# EAGLE design RecFinal0 (EAGLE 7.2.0)
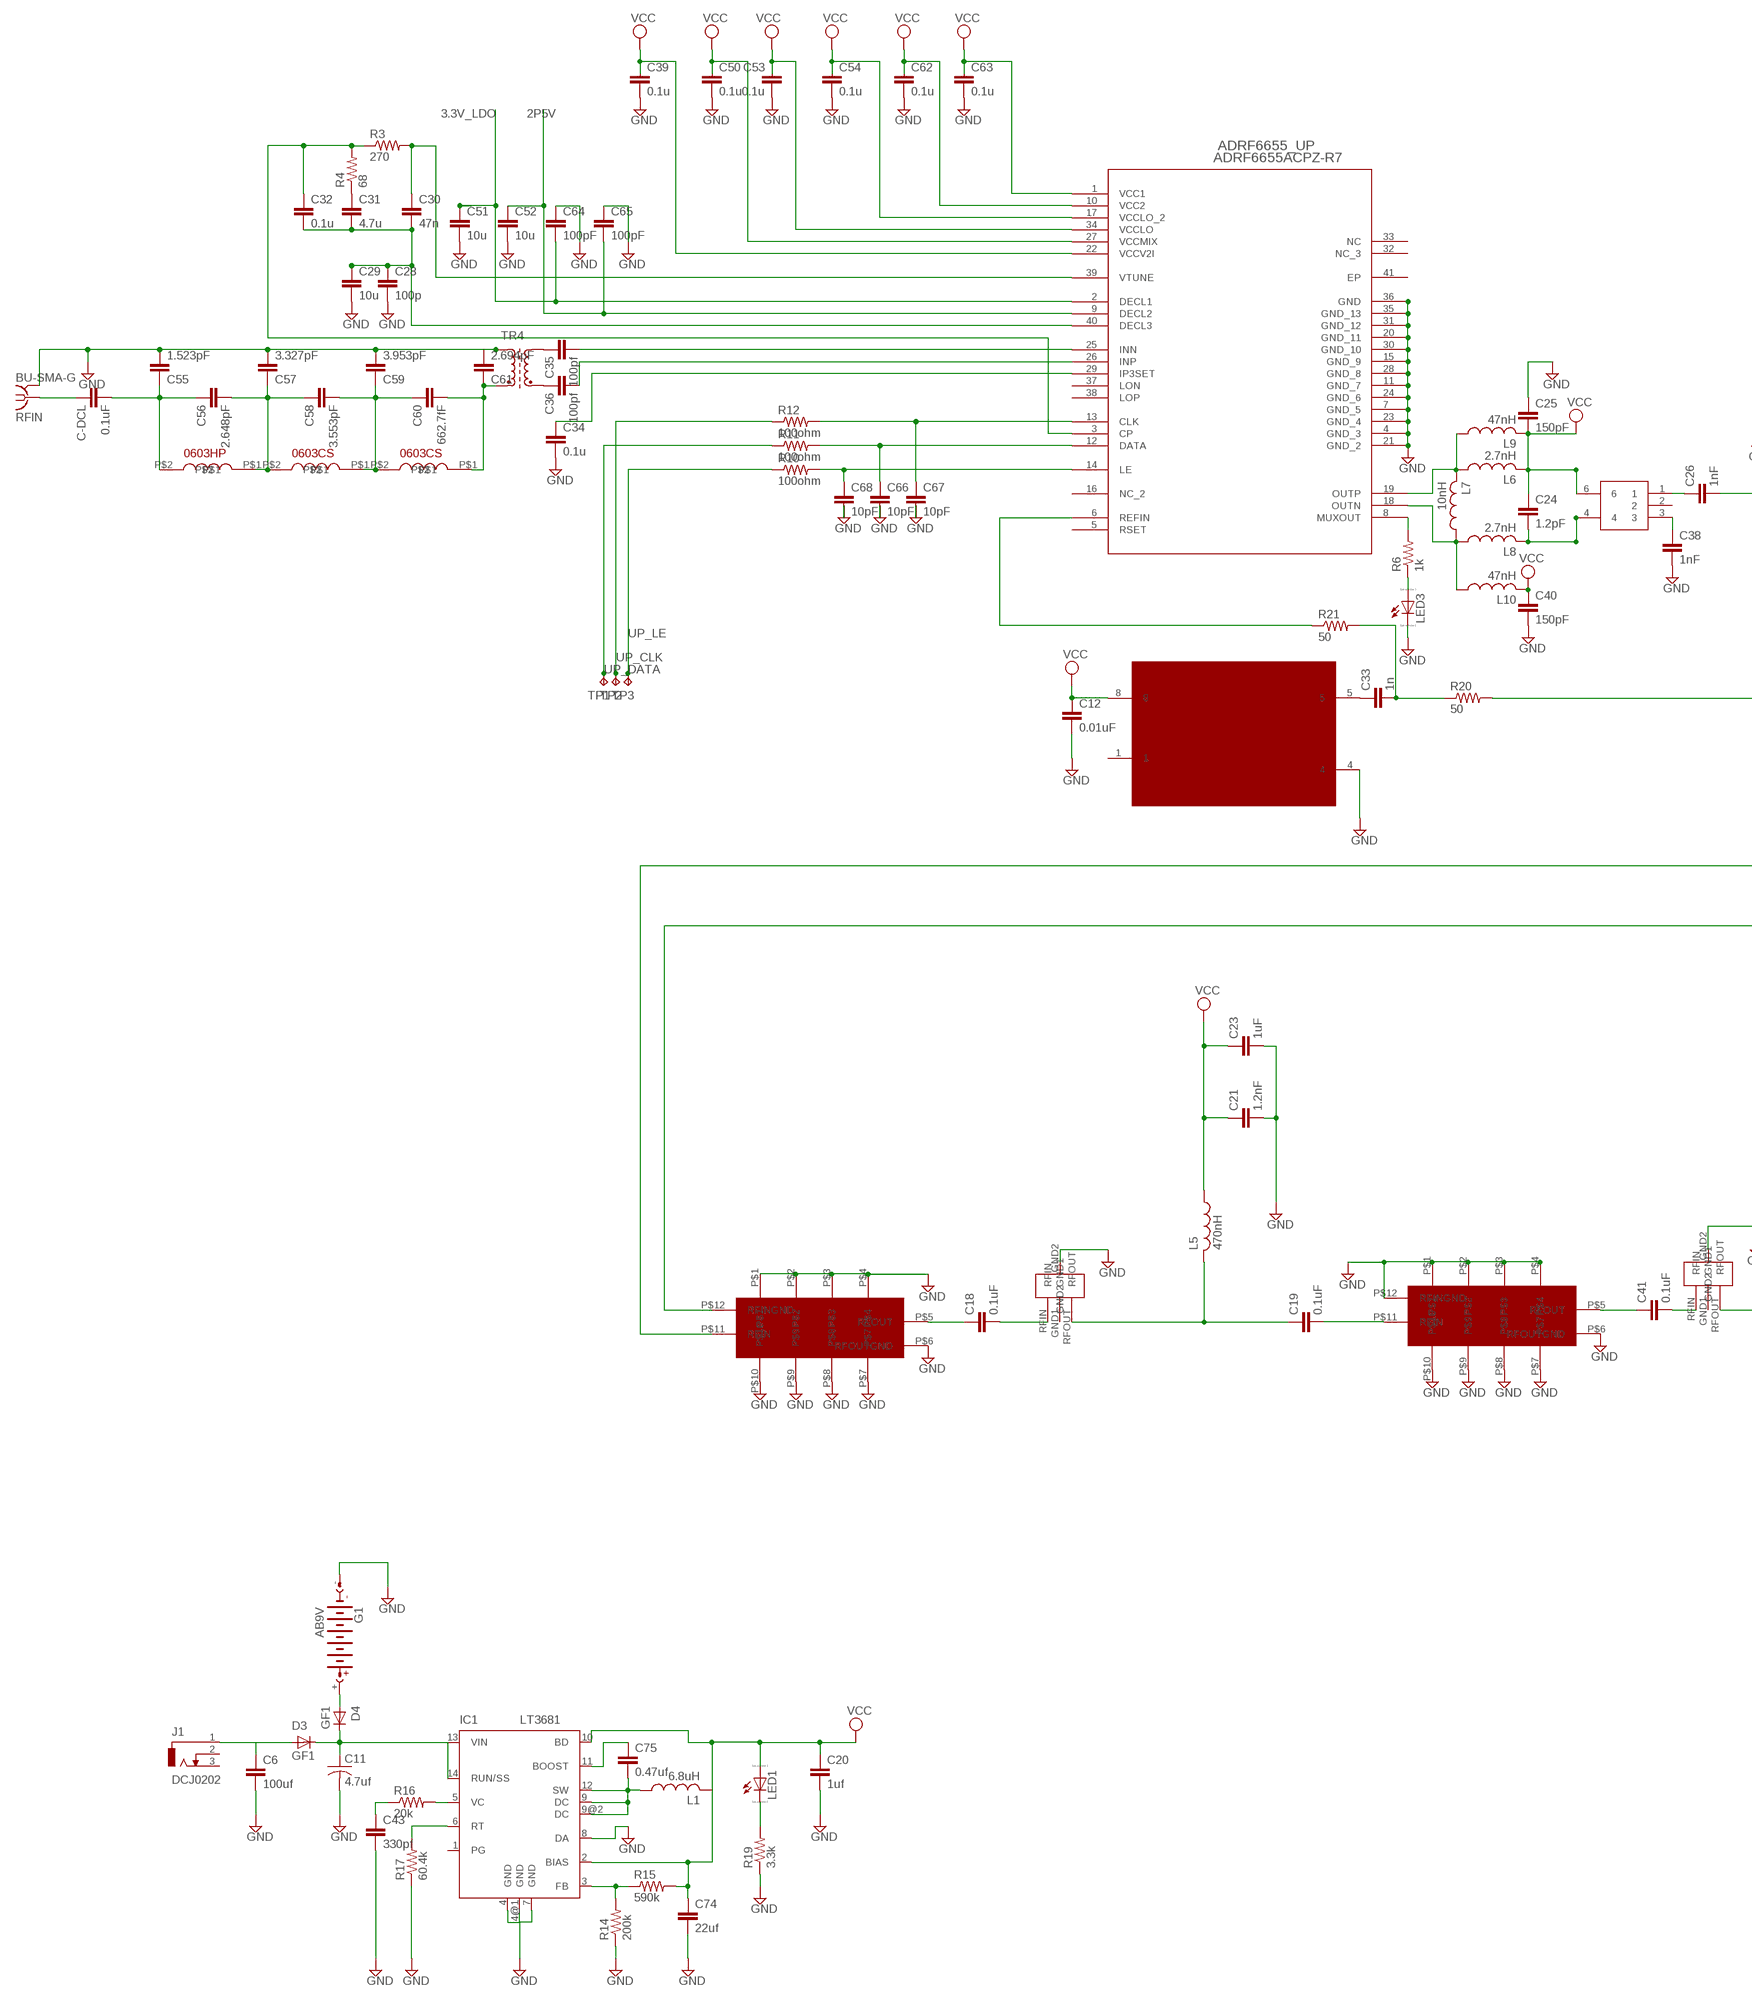
[diagram p0: schematic, sheet 1, part 1 of 2]
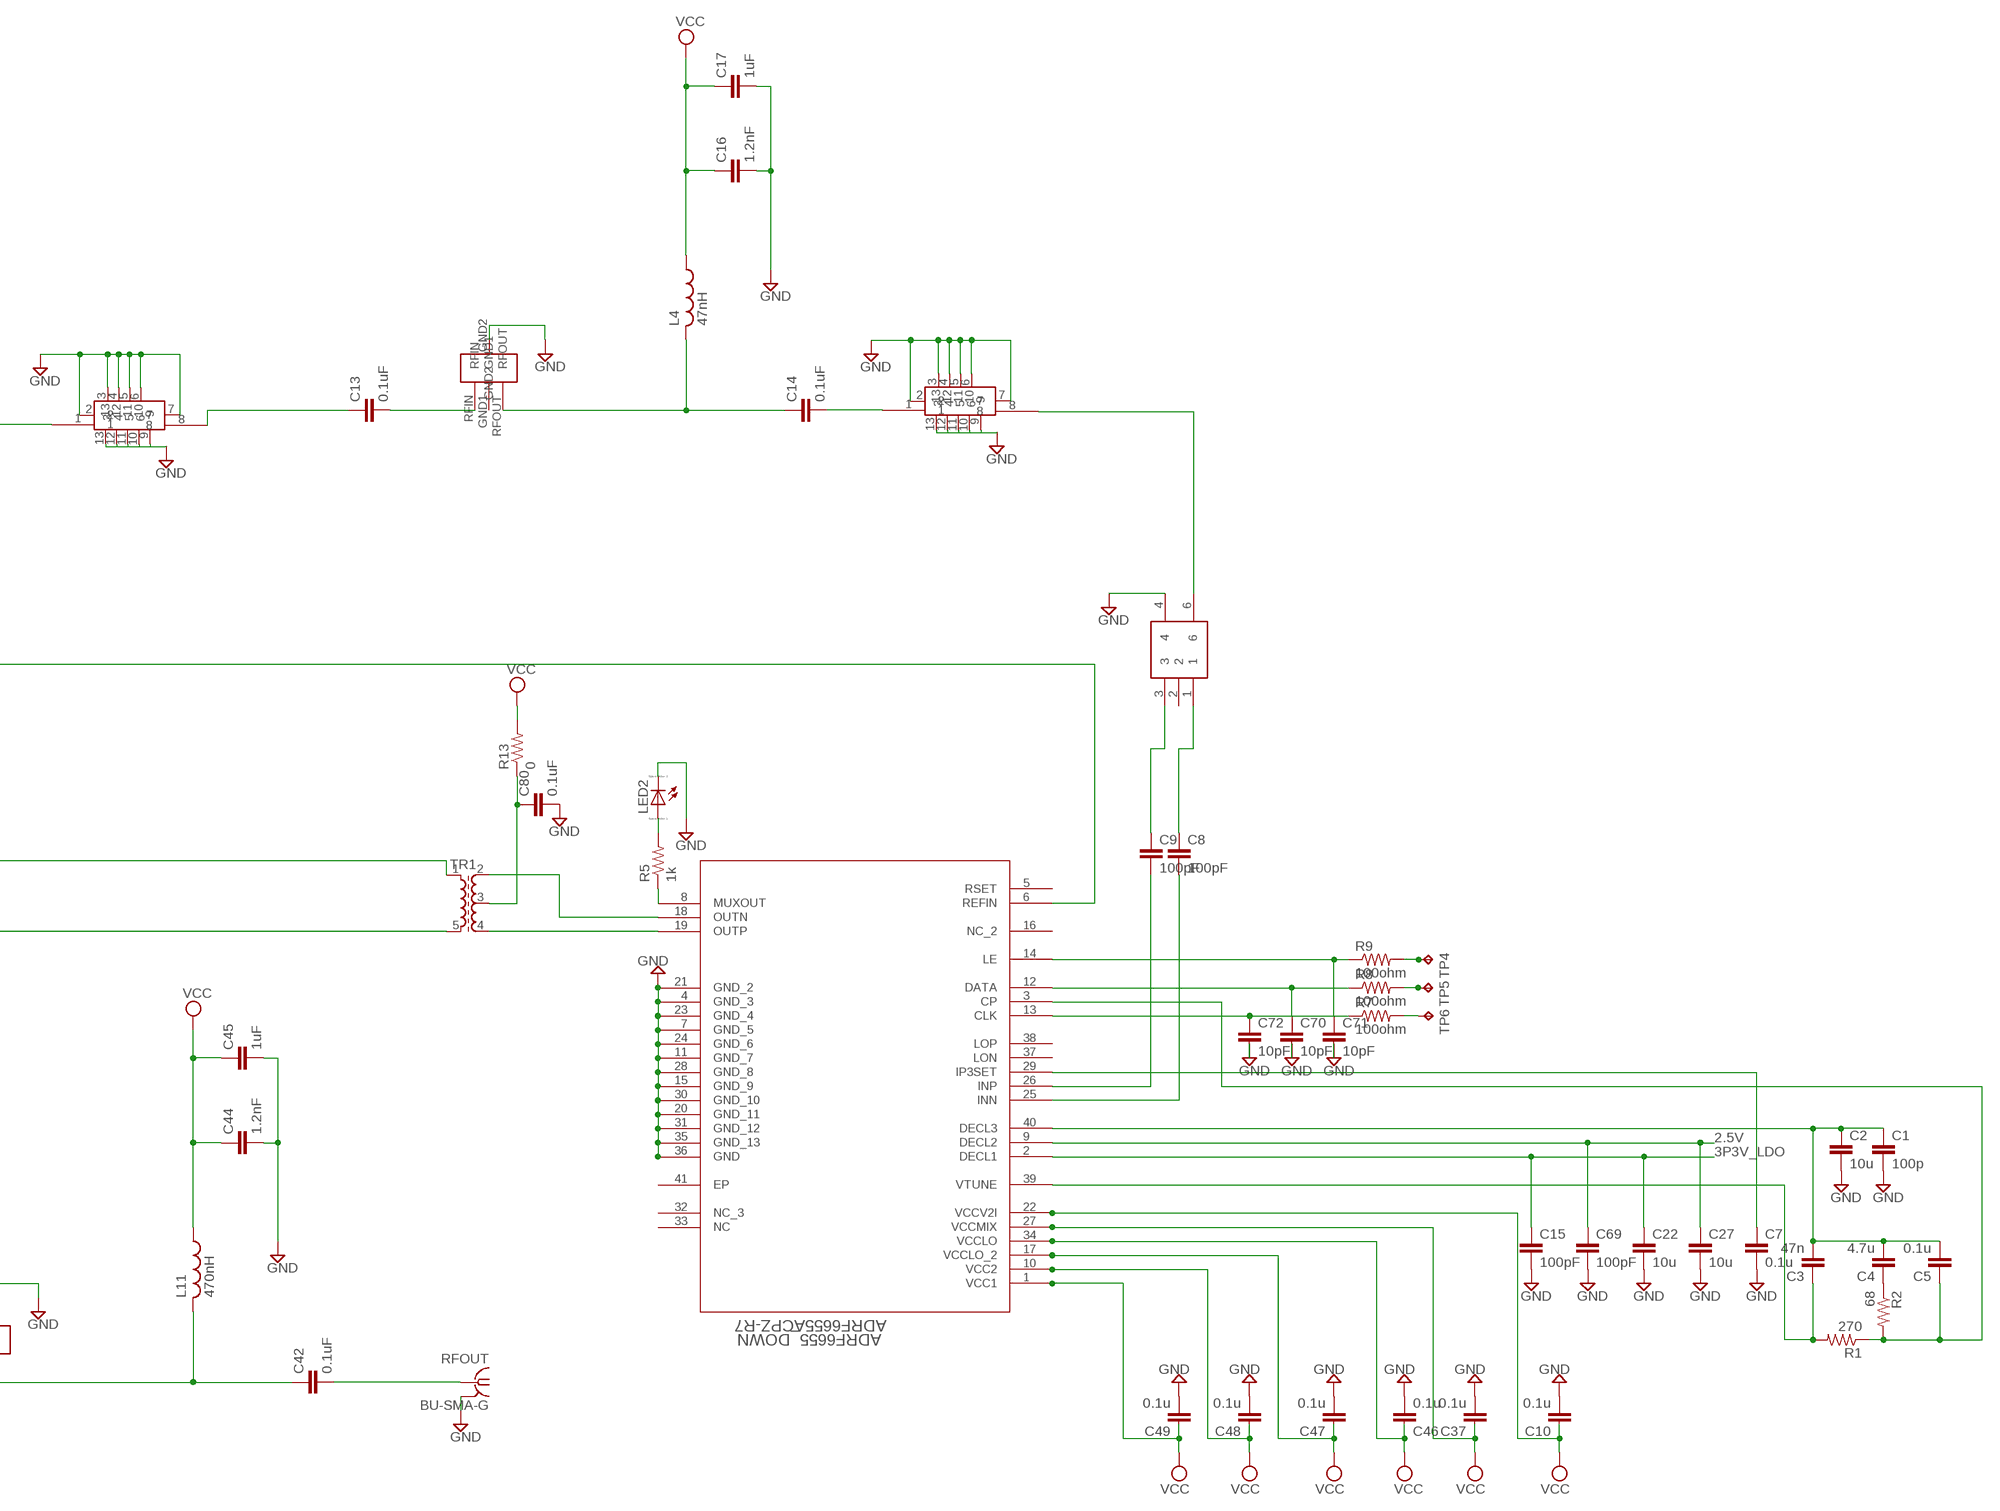
[diagram p1: schematic, sheet 1, part 2 of 2]

## Parts
06CS9N5  0603CS  [0603CS]
0603CS5N6  0603CS  [0603CS]
0603HP5N6  0603HP  [0603HP]
1401  SF2140A  [SF2140A]
1402  SF2140A  [SF2140A]
ADRF6655_DOWN  ADRF6655ACPZ-R7  [CP_40_1]
ADRF6655_UP  ADRF6655ACPZ-R7  [CP_40_1]
C1  100p  C-EUC0603K  [C0603K]
C2  10u  C-EUC0603K  [C0603K]
C3  47n  C-EUC0603K  [C0603K]
C4  4.7u  C-EUC0603K  [C0603K]
C5  0.1u  C-EUC0603K  [C0603K]
C6  100uf  C-EUC0603K  [C0603K]
C7  0.1u  C-EUC0603K  [C0603K]
C8  100pF  C-EUC0603K  [C0603K]
C9  100pF  C-EUC0603K  [C0603K]
C10  0.1u  C-EUC0603K  [C0603K]
C11  4.7uf  C-US050-024X044  [C050-024X044]
C12  0.01uF  C-EUC0603K  [C0603K]
C13  0.1uF  C-EUC0603K  [C0603K]
C14  0.1uF  C-EUC0603K  [C0603K]
C15  100pF  C-EUC0603K  [C0603K]
C16  1.2nF  C-EUC0603K  [C0603K]
C17  1uF  C-EUC0603K  [C0603K]
C18  0.1uF  C-EUC0603K  [C0603K]
C19  0.1uF  C-EUC0603K  [C0603K]
C20  1uf  C-EUC0603K  [C0603K]
C21  1.2nF  C-EUC0603K  [C0603K]
C22  10u  C-EUC0603K  [C0603K]
C23  1uF  C-EUC0603K  [C0603K]
C24  1.2pF  C-EUC0603K  [C0603K]
C25  150pF  C-EUC0603K  [C0603K]
C26  1nF  C-EUC0603K  [C0603K]
C27  10u  C-EUC0603K  [C0603K]
C28  100p  C-EUC0603K  [C0603K]
C29  10u  C-EUC0603K  [C0603K]
C30  47n  C-EUC0603K  [C0603K]
C31  4.7u  C-EUC0603K  [C0603K]
C32  0.1u  C-EUC0603K  [C0603K]
C33  1n  C-EUC0603K  [C0603K]
C34  0.1u  C-EUC0603K  [C0603K]
C35  100pf  C-EUC0603K  [C0603K]
C36  100pf  C-EUC0603K  [C0603K]
C37  0.1u  C-EUC0603K  [C0603K]
C38  1nF  C-EUC0603K  [C0603K]
C39  0.1u  C-EUC0603K  [C0603K]
C40  150pF  C-EUC0603K  [C0603K]
C41  0.1uF  C-EUC0603K  [C0603K]
C42  0.1uF  C-EUC0603K  [C0603K]
C43  330pf  C-EUC0603K  [C0603K]
C44  1.2nF  C-EUC0603K  [C0603K]
C45  1uF  C-EUC0603K  [C0603K]
C46  0.1u  C-EUC0603K  [C0603K]
C47  0.1u  C-EUC0603K  [C0603K]
C48  0.1u  C-EUC0603K  [C0603K]
C49  0.1u  C-EUC0603K  [C0603K]
C50  0.1u  C-EUC0603K  [C0603K]
C51  10u  C-EUC0603K  [C0603K]
C52  10u  C-EUC0603K  [C0603K]
C53  0.1u  C-EUC0603K  [C0603K]
C54  0.1u  C-EUC0603K  [C0603K]
C55  1.523pF  C-EUC0603K  [C0603K]
C56  2.648pF  C-EUC0603K  [C0603K]
C57  3.327pF  C-EUC0603K  [C0603K]
C58  3.553pF  C-EUC0603K  [C0603K]
C59  3.953pF  C-EUC0603K  [C0603K]
C60  662.7fF  C-EUC0603K  [C0603K]
C61  2.694pF  C-EUC0603K  [C0603K]
C62  0.1u  C-EUC0603K  [C0603K]
C63  0.1u  C-EUC0603K  [C0603K]
C64  100pF  C-EUC0603K  [C0603K]
C65  100pF  C-EUC0603K  [C0603K]
C66  10pF  C-EUC0603K  [C0603K]
C67  10pF  C-EUC0603K  [C0603K]
C68  10pF  C-EUC0603K  [C0603K]
C69  100pF  C-EUC0603K  [C0603K]
C70  10pF  C-EUC0603K  [C0603K]
C71  10pF  C-EUC0603K  [C0603K]
C72  10pF  C-EUC0603K  [C0603K]
C74  22uf  C-EUC0603K  [C0603K]
C75  0.47uf  C-EUC0603K  [C0603K]
C80  0.1uF  C-EUC0603K  [C0603K]
C-DCL  0.1uF  C-EUC0603K  [C0603K]
D3  GF1  [SMA-DO214AC]
D4  GF1  [SMA-DO214AC]
G1  AB9V  [AB9V]
IC1  LT3681  [DFN14-4X3DE]
J1  DCJ0202  [DCJ0202]
L1  6.8uH  L-USL2012C  [L2012C]
L4  47nH  L-USL2012C  [L2012C]
L5  470nH  L-USL2012C  [L2012C]
L6  2.7nH  L-USL2012C  [L2012C]
L7  10nH  L-USL2012C  [L2012C]
L8  2.7nH  L-USL2012C  [L2012C]
L9  47nH  L-USL2012C  [L2012C]
L10  47nH  L-USL2012C  [L2012C]
L11  470nH  L-USL2012C  [L2012C]
LED1  LED_ESML0603  [LED_SML0603]
LED2  LED_ESML0603  [LED_SML0603]
LED3  LED_ESML0603  [LED_SML0603]
R1  270  R-US_R0603  [R0603]
R2  68  R-US_R0603  [R0603]
R3  270  R-US_R0603  [R0603]
R4  68  R-US_R0603  [R0603]
R5  1k  R-US_R0603  [R0603]
R6  1k  R-US_R0603  [R0603]
R7  100ohm  R-US_R0603  [R0603]
R8  100ohm  R-US_R0603  [R0603]
R9  100ohm  R-US_R0603  [R0603]
R10  100ohm  R-US_R0603  [R0603]
R11  100ohm  R-US_R0603  [R0603]
R12  100ohm  R-US_R0603  [R0603]
R13  0  R-US_R0603  [R0603]
R14  200k  R-US_R0603  [R0603]
R15  590k  R-US_R0603  [R0603]
R16  20k  R-US_R0603  [R0603]
R17  60.4k  R-US_R0603  [R0603]
R19  3.3k  R-US_R0603  [R0603]
R20  50  R-US_R0603  [R0603]
R21  50  R-US_R0603  [R0603]
RFIN  BU-SMA-G  [BU-SMA-G]
RFOUT  BU-SMA-G  [BU-SMA-G]
T$2  CUSTOM_TRANSFORMER  [CUSTOM_TRANSFORMER]
T$3  CUSTOM_TRANSFORMER  [CUSTOM_TRANSFORMER]
TP1  TPPAD1-13  [P1-13]
TP2  TPPAD1-13  [P1-13]
TP3  TPPAD1-13  [P1-13]
TP4  TPPAD1-13  [P1-13]
TP5  TPPAD1-13  [P1-13]
TP6  TPPAD1-13  [P1-13]
TR1  SM-T4-2T  [SM-T4]
TR4  SM-T4  [SM-T4]
U$1  MXO45  [MXO45]
U$2  RCFD1  [RCFD1]
U$3  ADL5320  [ADL5320]
U$4  RCFD1  [RCFD1]
U$5  ADL5320  [ADL5320]
U$6  ADL5320  [ADL5320]

## Nets
2.5V: ADRF6655_DOWN.9(DECL2) C27.1 C69.1
2P5V: ADRF6655_UP.9(DECL2) C52.1 C65.2
3.3V_LDO: ADRF6655_UP.2(DECL1) C51.1 C64.2
3P3V_LDO: ADRF6655_DOWN.2(DECL1) C15.1 C22.1
DOWN_CLK: R7.2 TP6.TP
DOWN_DATA: R8.2 TP5.TP
DOWN_LE: R9.2 TP4.TP
GND: 1401.P$1 1401.P$2 1401.P$3 1401.P$4 1401.P$6(RFOUTGND) 1401.P$7 1401.P$8 1401.P$9 1401.P$10 1402.P$1 1402.P$2 1402.P$3 1402.P$4 1402.P$6(RFOUTGND) 1402.P$7 1402.P$8 1402.P$9 1402.P$10 1402.P$12(RFINGND) ADRF6655_DOWN.4(GND_3) ADRF6655_DOWN.7(GND_5) ADRF6655_DOWN.11(GND_7) ADRF6655_DOWN.15(GND_9) ADRF6655_DOWN.20(GND_11) ADRF6655_DOWN.21(GND_2) ADRF6655_DOWN.23(GND_4) ADRF6655_DOWN.24(GND_6) ADRF6655_DOWN.28(GND_8) ADRF6655_DOWN.30(GND_10) ADRF6655_DOWN.31(GND_12) ADRF6655_DOWN.35(GND_13) ADRF6655_DOWN.36(GND) ADRF6655_UP.4(GND_3) ADRF6655_UP.7(GND_5) ADRF6655_UP.11(GND_7) ADRF6655_UP.15(GND_9) ADRF6655_UP.20(GND_11) ADRF6655_UP.21(GND_2) ADRF6655_UP.23(GND_4) ADRF6655_UP.24(GND_6) ADRF6655_UP.28(GND_8) ADRF6655_UP.30(GND_10) ADRF6655_UP.31(GND_12) ADRF6655_UP.35(GND_13) ADRF6655_UP.36(GND) C1.2 C2.2 C6.2 C7.2 C10.2 C11.2 C12.2 C15.2 C16.2 C17.2 C20.2 C21.2 C22.2 C23.2 C25.1 C27.2 C28.2 C29.2 C34.2 C37.2 C38.2 C39.2 C40.2 C43.2 C44.2 C45.2 C46.2 C47.2 C48.2 C49.2 C50.2 C51.2 C52.2 C53.2 C54.2 C55.2 C57.2 C59.2 C61.2 C62.2 C63.2 C64.1 C65.1 C66.2 C67.2 C68.2 C69.2 C70.2 C71.2 C72.2 C74.2 C80.2 G1.- IC1.4(GND) IC1.4@1(GND) IC1.7(GND) IC1.8(DA) LED2.C LED3.C R14.1 R17.1 R19.1 RFIN.2 RFIN.3 RFIN.4 RFIN.5 RFOUT.2 RFOUT.3 RFOUT.4 RFOUT.5 T$3.4 TR4.1(A1) U$1.4 U$2.2 U$2.3 U$2.4 U$2.5 U$2.6 U$2.7 U$2.9 U$2.10 U$2.11 U$2.12 U$2.13 U$4.2 U$4.3 U$4.4 U$4.5 U$4.6 U$4.7 U$4.9 U$4.10 U$4.11 U$4.12 U$4.13 U$5.GND2
N$1: ADRF6655_UP.39(VTUNE) C30.1 R3.2
N$2: ADRF6655_DOWN.39(VTUNE) C3.1 R1.2
N$4: ADRF6655_DOWN.40(DECL3) C1.1 C2.1 C3.2 C4.2 C5.2
N$5: ADRF6655_DOWN.6(REFIN) R20.2
N$6: ADRF6655_DOWN.14(LE) C71.1 R9.1
N$7: ADRF6655_DOWN.12(DATA) C70.1 R8.1
N$8: ADRF6655_DOWN.29(IP3SET) C7.1
N$9: ADRF6655_DOWN.26(INP) C9.2
N$10: ADRF6655_DOWN.25(INN) C8.2
N$11: ADRF6655_DOWN.18(OUTN) TR1.2
N$12: ADRF6655_DOWN.19(OUTP) TR1.4
N$13: C38.1 T$2.3
N$14: ADRF6655_UP.3(CP) C32.1 R3.1 R4.2
N$15: ADRF6655_UP.40(DECL3) C28.1 C29.1 C30.2 C31.2 C32.2
N$16: C33.1 U$1.5
N$17: C26.2 U$2.1
N$18: ADRF6655_UP.13(CLK) C67.1 R12.2
N$19: ADRF6655_UP.29(IP3SET) C34.1
N$20: ADRF6655_UP.25(INN) C35.2
N$21: ADRF6655_UP.26(INP) C36.2
N$22: C-DCL.1 RFIN.1
N$23: 0603HP5N6.P$2 C55.1 C56.1 C-DCL.2
N$24: C41.2 U$5.RFIN
N$25: 06CS9N5.P$1 C60.2 C61.1 TR4.2(E1)
N$26: 06CS9N5.P$2 0603CS5N6.P$1 C58.2 C59.1 C60.1
N$27: 0603CS5N6.P$2 0603HP5N6.P$1 C56.2 C57.1 C58.1
N$28: C13.1 U$2.8
N$29: ADRF6655_UP.12(DATA) C66.1 R11.2
N$30: C31.1 R4.1
N$31: C4.1 R2.1
N$32: C14.1 L4.2 U$3.RFOUT
N$33: ADRF6655_UP.8(MUXOUT) R6.2
N$34: LED3.A R6.1
N$35: C14.2 U$4.1
N$37: IC1.5(VC) R16.2
N$38: ADRF6655_DOWN.3(CP) C5.1 R1.1 R2.2
N$39: C19.1 L5.2 U$6.RFOUT
N$40: 1401.P$5(RFOUT) C18.1
N$41: 1402.P$11(RFIN) C19.2
N$42: ADRF6655_UP.19(OUTP) L6.1 L7.2 L9.1
N$43: ADRF6655_UP.18(OUTN) L7.1 L8.1 L10.1
N$44: ADRF6655_DOWN.13(CLK) C72.1 R7.1
N$45: T$3.6 U$4.8
N$47: C24.2 L8.2 T$2.4
N$48: ADRF6655_UP.6(REFIN) R21.1
N$49: C33.2 R20.1 R21.2
N$50: C80.1 R13.1 TR1.3
N$51: 1401.P$12(RFINGND) TR1.5
N$52: 1401.P$11(RFIN) TR1.1
N$53: C18.2 U$6.RFIN
N$54: C42.1 L11.2 U$5.RFOUT
N$55: 1402.P$5(RFOUT) C41.1
N$56: C42.2 RFOUT.1
N$57: C9.1 T$3.3
N$58: C8.1 T$3.1
N$59: C35.1 TR4.5(A2)
N$60: C36.1 TR4.4(E2)
N$61: ADRF6655_UP.14(LE) C68.1 R10.2
N$62: ADRF6655_DOWN.8(MUXOUT) R5.1
N$63: C13.2 U$3.RFIN
N$64: C26.1 T$2.1
N$65: IC1.6(RT) R17.2
N$66: C43.1 R16.1
N$67: IC1.3(FB) R14.2 R15.1
N$69: C75.1 IC1.11(BOOST)
N$72: LED2.A R5.2
N$73: C11.1 D3.K(C) D4.K(C) IC1.13(VIN) IC1.14(RUN/SS)
N$74: D4.A G1.+
N$75: C75.2 IC1.9(DC) IC1.9@2(DC) IC1.12(SW) L1.1
N$76: LED1.C R19.2
N$78: C6.1 D3.A J1.1
UP_CLK: R12.1 TP2.TP
UP_DATA: R11.1 TP1.TP
UP_LE: R10.1 TP3.TP
VCC: ADRF6655_DOWN.1(VCC1) ADRF6655_DOWN.10(VCC2) ADRF6655_DOWN.17(VCCLO_2) ADRF6655_DOWN.22(VCCV2I) ADRF6655_DOWN.27(VCCMIX) ADRF6655_DOWN.34(VCCLO) ADRF6655_UP.1(VCC1) ADRF6655_UP.10(VCC2) ADRF6655_UP.17(VCCLO_2) ADRF6655_UP.22(VCCV2I) ADRF6655_UP.27(VCCMIX) ADRF6655_UP.34(VCCLO) C10.1 C12.1 C16.1 C17.1 C20.1 C21.1 C23.1 C24.1 C25.2 C37.1 C39.1 C40.1 C44.1 C45.1 C46.1 C47.1 C48.1 C49.1 C50.1 C53.1 C54.1 C62.1 C63.1 C74.1 IC1.2(BIAS) IC1.10(BD) L1.2 L4.1 L5.1 L6.2 L9.2 L10.2 L11.1 LED1.A R13.2 R15.2 T$2.6 U$1.8
Unconnected: ADRF6655_DOWN.5(RSET) ADRF6655_DOWN.16(NC_2) ADRF6655_DOWN.32(NC_3) ADRF6655_DOWN.33(NC) ADRF6655_DOWN.37(LON) ADRF6655_DOWN.38(LOP) ADRF6655_DOWN.41(EP) ADRF6655_UP.5(RSET) ADRF6655_UP.16(NC_2) ADRF6655_UP.32(NC_3) ADRF6655_UP.33(NC) ADRF6655_UP.37(LON) ADRF6655_UP.38(LOP) ADRF6655_UP.41(EP) IC1.1(PG) J1.2 J1.3 T$2.2 T$3.2 U$1.1 U$3.GND1 U$3.GND2 U$5.GND1 U$6.GND1 U$6.GND2

## Library data of the parts
06CS9N5 0603CS5N6 = 0603CS:0603CS
0603HP5N6 = 0603HP:0603HP
1401 1402 = sf2140a:SF2140A
ADRF6655_DOWN ADRF6655_UP = adrf6655:ADRF6655ACPZ-R7
C1-C10 C12-C72 C74 C75 C80 C-DCL = rcl:C-EU: CAPACITOR, European symbol
C11 = rcl:C-US: CAPACITOR, American symbol
D3 D4 = diode:GF1: DIODE
G1 = battery:AB9V: 9-V BATTERY CLIP
IC1 = linear-technology:LT3681: 36V, 2A, 2.8MHz Step-Down Switching Regulator with Integrated Power Schottky Diode Source: http://www.linear.com/pc/downloadDocument.do?navId=H0,C1,C1003,C1042,C1032,C1064,P38040,D25144; MPN: LT3681EDE#PBF; OC_FARNELL: 1627603; OC_NEWARK: 57M8550
J1 = con-jack:DCJ0202: DC POWER JACK Source: DCJ0202.pdf; OC_FARNELL: unknown; OC_NEWARK: unknown
L1 L4-L11 = rcl:L-US: INDUCTOR, American symbol
LED1-LED3 = eagle-ltspice:LED_E: LED Source: http://www.osram.convergy.de Source: www.luxeon.com Source: www.kingbright.com; SPICEMODEL: NONE; SPICEPREFIX: D; SPICETYPE: diode
R1-R4 R7-R12 R20 R21 = rcl:R-US_: RESISTOR, American symbol
R5 R6 R13-R17 R19 = resistor:R-US_: RESISTOR, American symbol
RFIN RFOUT = con-coax:BU-SMA-G: FEMALE SMA CONNECTOR Radiall distributor RS 193-9117; OC_FARNELL: unknown; OC_NEWARK: unknown
T$2 T$3 = CUSTOM_TRANSFORMER:CUSTOM_TRANSFORMER
TP1-TP6 = testpad:TP: Test pad
TR1 = inductor-neosid:SM-T4-2T: TRANSFORMER SMD wideband transformer with tab; OC_FARNELL: unknown; OC_NEWARK: unknown
TR4 = inductor-neosid:SM-T4: TRANSFORMER SMD wideband transformer; OC_FARNELL: unknown; OC_NEWARK: unknown
U$1 = mxo45:MXO45
U$2 U$4 = RCFD1:RCFD1
U$3 U$5 U$6 = ADL5320:ADL5320

## Board
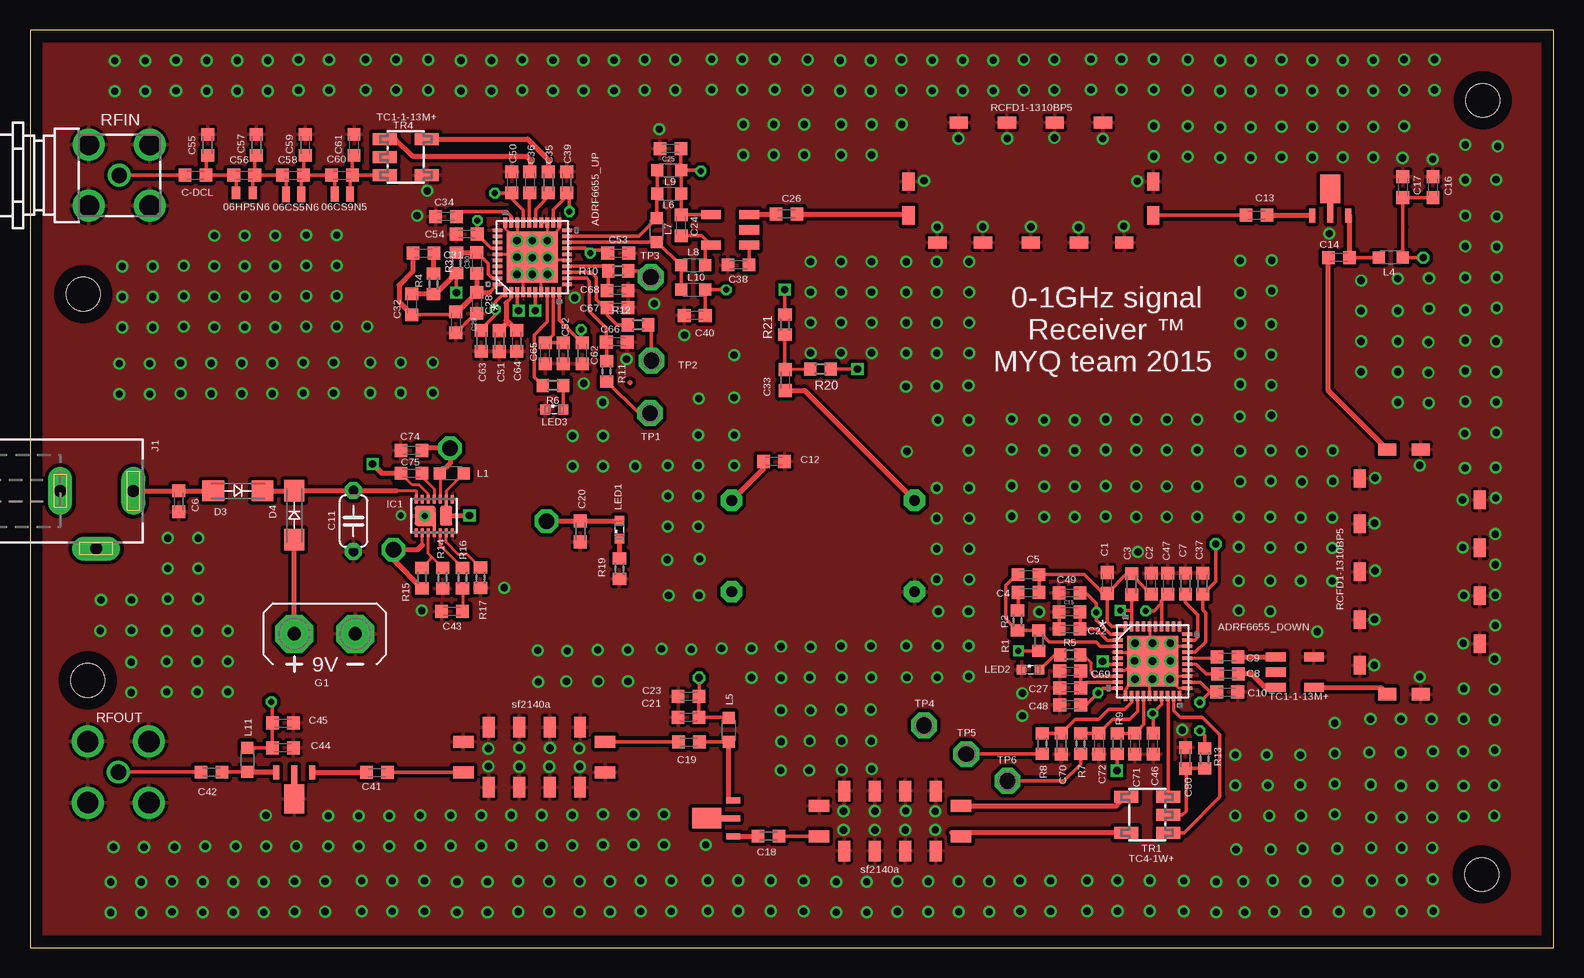
[diagram p2: board, top side]
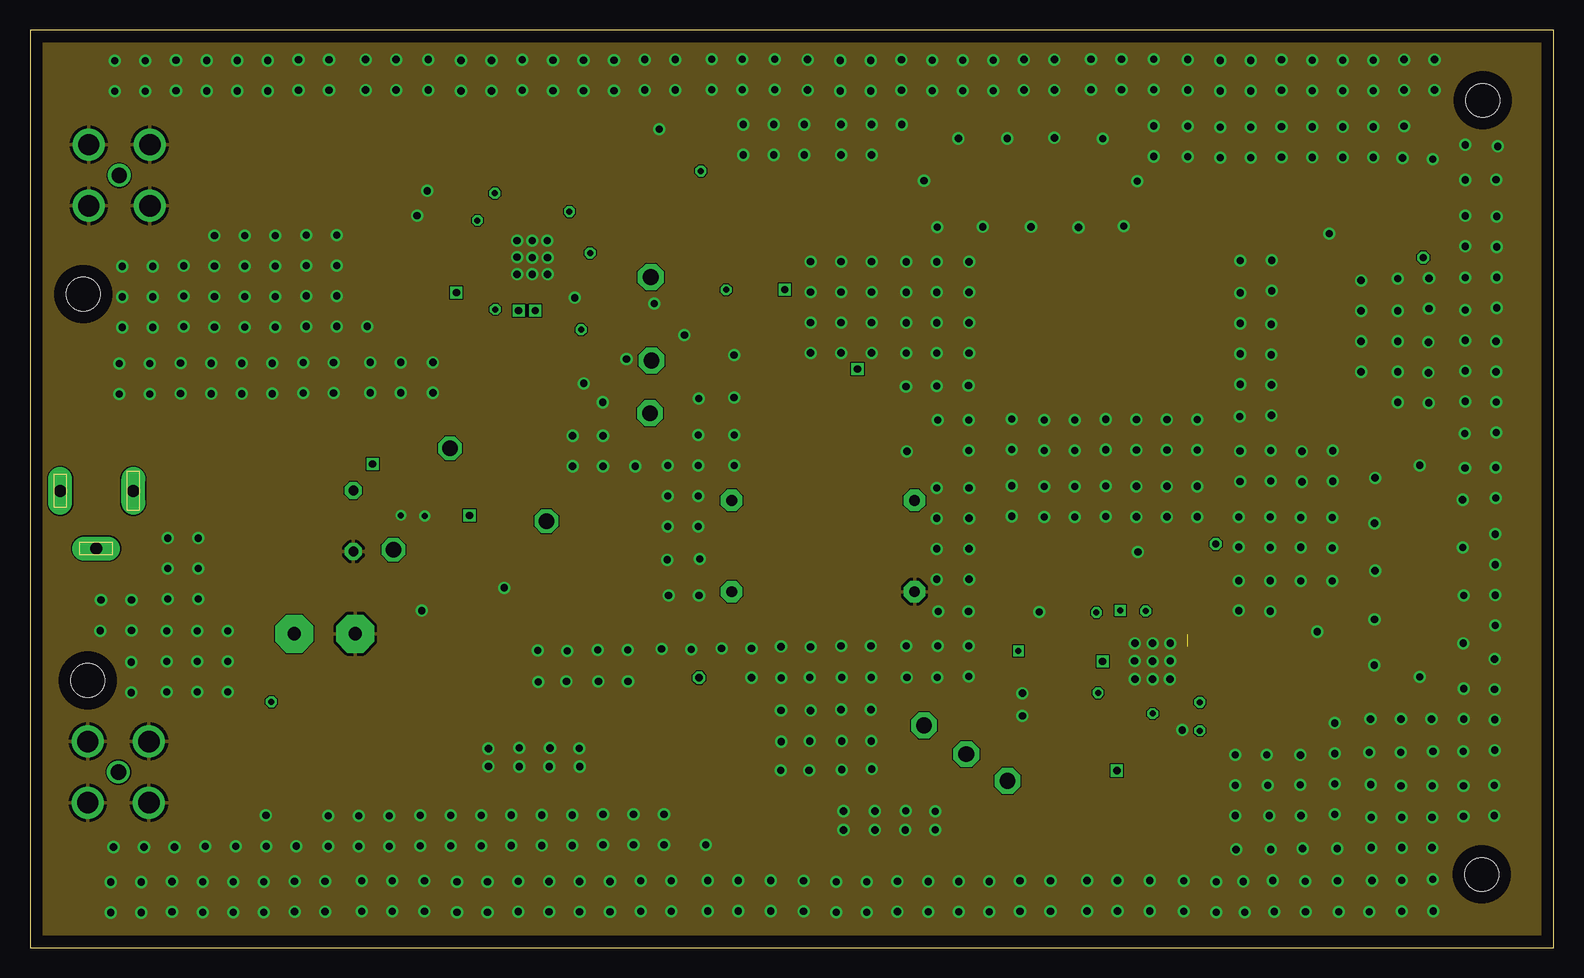
[diagram p3: board, inner layer Route2]
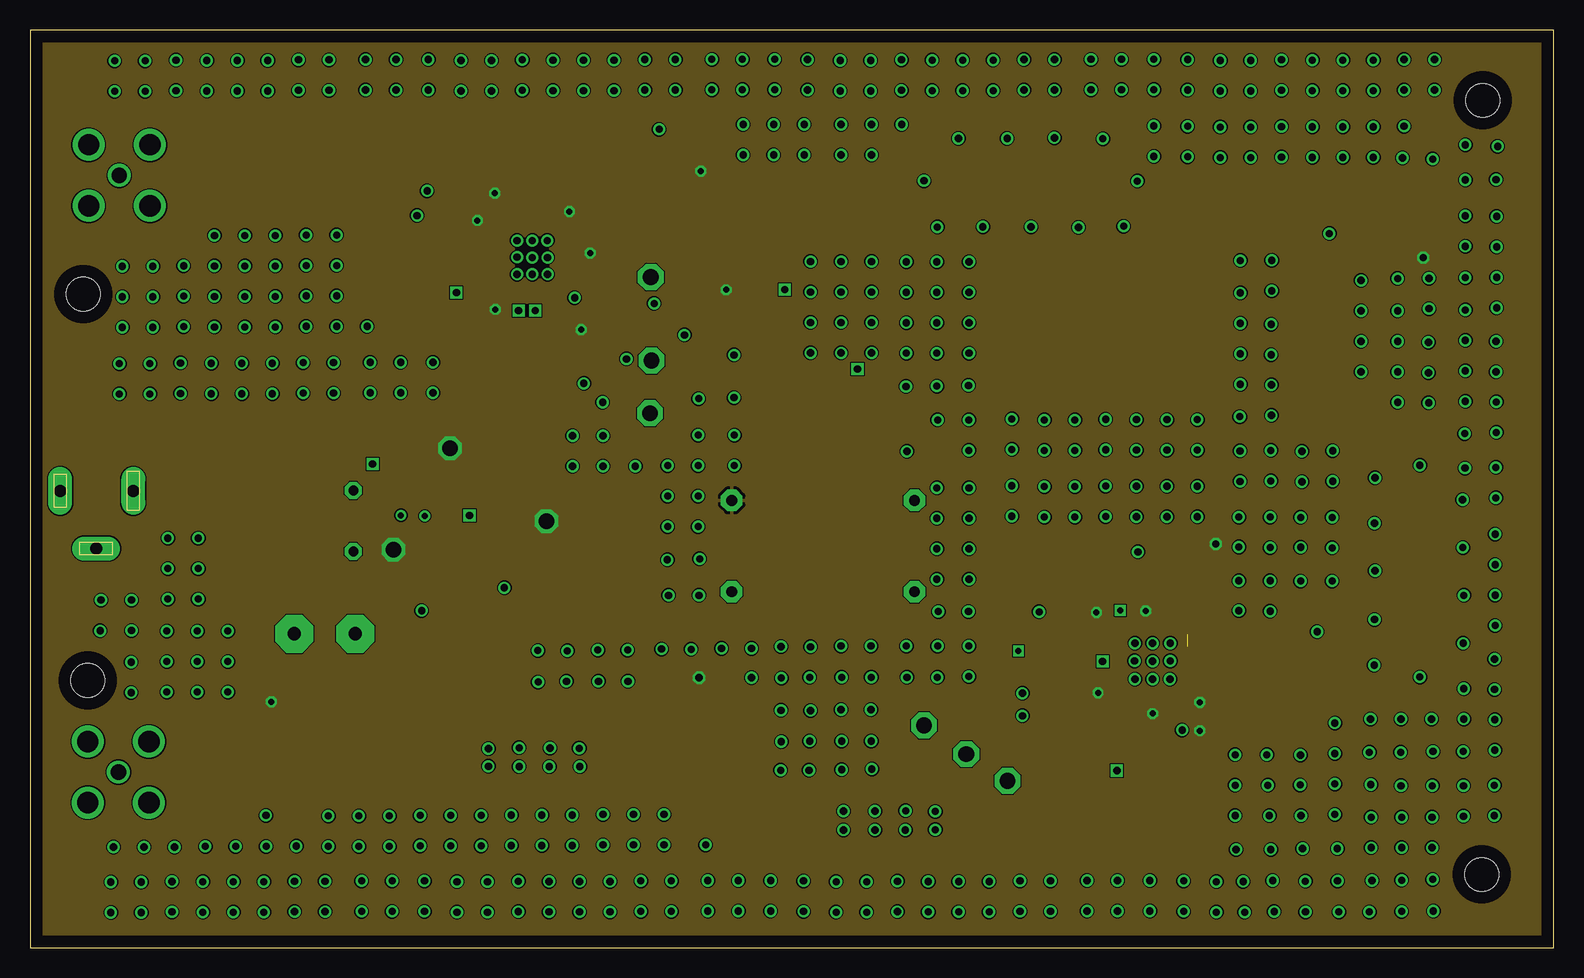
[diagram p4: board, inner layer Route3]
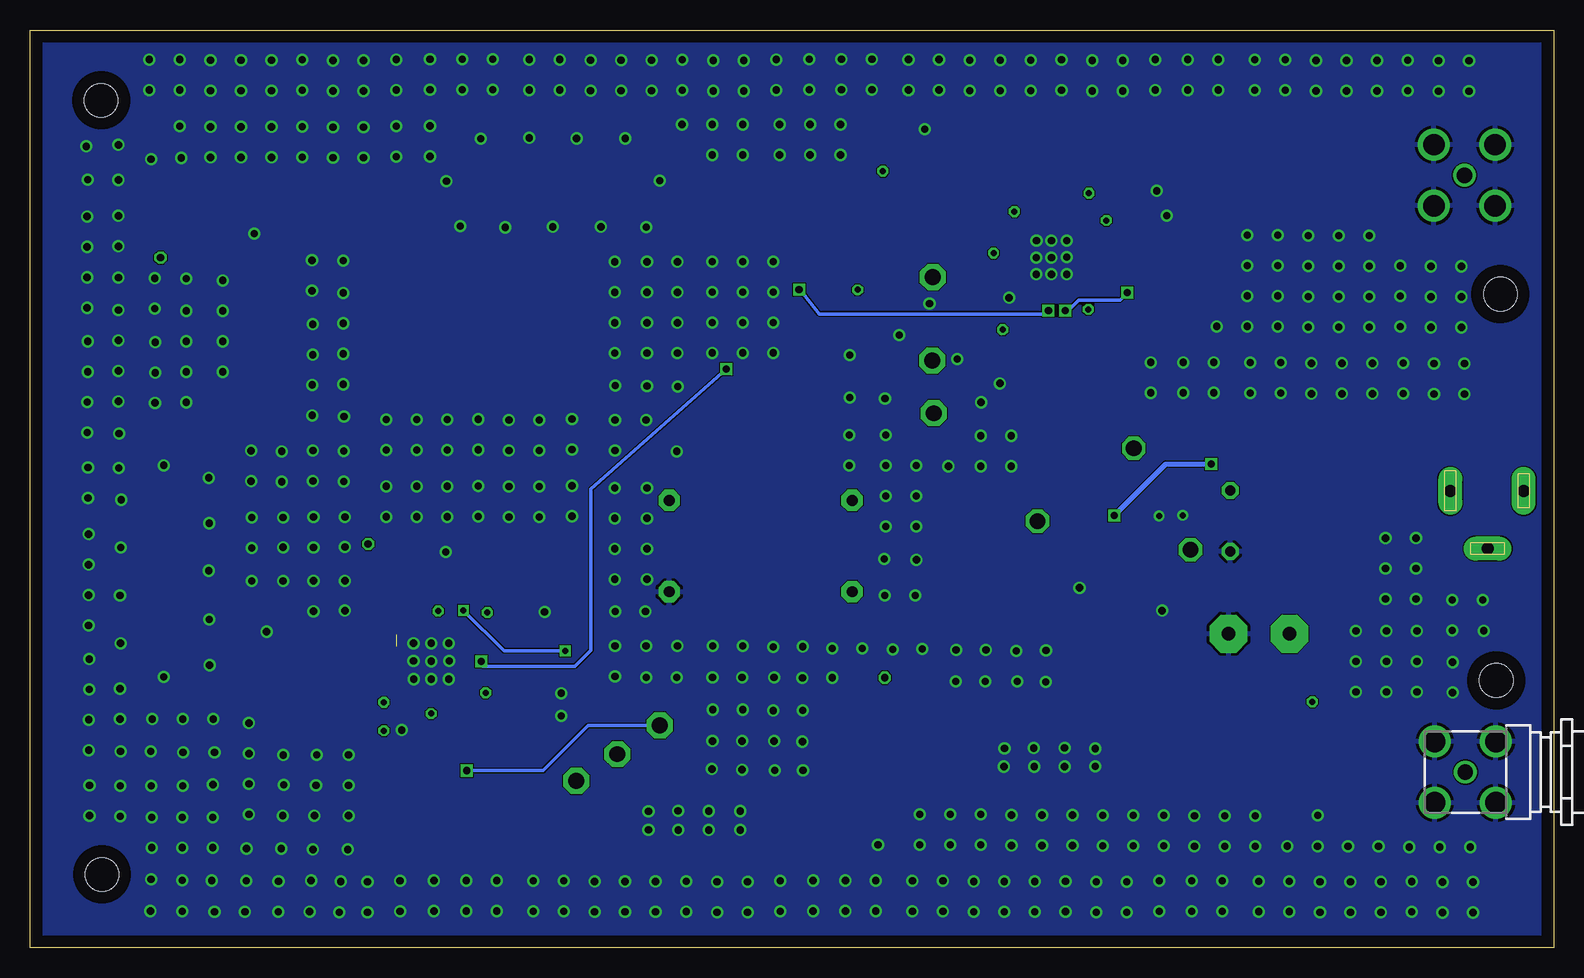
[diagram p5: board, bottom side, seen from below]

Size 126.98 x 76.5 mm. Coordinates in mm from the lower left corner, seen from the top.
Outline: 0,0 126.98,0 126.98,76.5 0,76.5 0,0
Copper layers (1*2*3*16): Top 0.035mm / dielectric 0.18mm / Route2 0.035mm / dielectric 0.5mm / Route3 0.035mm / dielectric 0.18mm / Bottom 0.035mm
Design rules "default *": minimum track width 6mil, minimum drill 10mil, track to track 4mil, track to pad 4mil, pad to pad 4mil, via to via 4mil, smd to smd 4mil, copper to edge 40mil, drill to drill 8mil, minimum pad ring 12mil, minimum via ring 8mil, stop-mask expansion 4mil, vias tented up to drill 0mil, thermal gap 10mil
Holes 2.8 mm at 4.45,54.48 4.8,22.28 120.98,6.1 121.06,70.64

### Footprints (pad centres in the part's own frame; a part is rotated, then mirrored left to right if it is on the bottom)
0603CS = smd 1.27 x 0.635: P$1 0,-0.635; P$2 0,0.635
0603HP = smd 1.016 x 0.686: P$1 0,-0.635; P$2 0,0.762
SF2140A = smd 0.99 x 1.7: P$1 -3.8,2.408; P$2 -1.26,2.408; P$3 1.28,2.408; P$4 3.82,2.408; P$7 3.82,-2.592; P$8 1.28,-2.592; P$9 -1.26,-2.592; P$10 -3.8,-2.592 | smd 1.7 x 0.99: P$5 5.915,1.178; P$6 5.915,-1.362; P$11 -5.895,-1.362; P$12 -5.895,1.178
CP_40_1 = smd 0.813 x 0.305: 1 -2.896,2.25; 2 -2.896,1.75; 3 -2.896,1.25; 4 -2.896,0.75; 5 -2.896,0.25; 6 -2.896,-0.25; 7 -2.896,-0.75; 8 -2.896,-1.25; 9 -2.896,-1.75; 10 -2.896,-2.25; 21 2.896,-2.25; 22 2.896,-1.75; 23 2.896,-1.25; 24 2.896,-0.75; 25 2.896,-0.25; 26 2.896,0.25; 27 2.896,0.75; 28 2.896,1.25; 29 2.896,1.75; 30 2.896,2.25 | smd 0.305 x 0.813: 11 -2.25,-2.896; 12 -1.75,-2.896; 13 -1.25,-2.896; 14 -0.75,-2.896; 15 -0.25,-2.896; 16 0.25,-2.896; 17 0.75,-2.896; 18 1.25,-2.896; 19 1.75,-2.896; 20 2.25,-2.896; 31 2.25,2.896; 32 1.75,2.896; 33 1.25,2.896; 34 0.75,2.896; 35 0.25,2.896; 36 -0.25,2.896; 37 -0.75,2.896; 38 -1.25,2.896; 39 -1.75,2.896; 40 -2.25,2.896 | smd 4.242 x 4.242: 41 0,0
C0603K = smd 1.05 x 1.08: 1 -0.875,0; 2 0.875,0
C050-024X044 = drill 0.813 octagon: 1 -2.54,0; 2 2.54,0
SMA-DO214AC = smd 1.8 x 1.7: A -2.05,0; K 2.05,0
AB9V = drill 1.118 pad 3.15 octagon: + 0,2.54; - 0,-2.54
DFN14-4X3DE = smd 0.25 x 0.7: 1 -1.5,-1.4; 2 -1,-1.4; 3 -0.5,-1.4; 5 0.5,-1.4; 6 1,-1.4; 7 1.5,-1.4; 8 1.5,1.4; 10 0.5,1.4; 11 0,1.4; 12 -0.5,1.4; 13 -1,1.4; 14 -1.5,1.4 | smd 0.25 x 2: 4 0,-0.75; 9 1,0.75 | smd 1.75 x 1.65: 4@1 -0.75,0 | smd 1.07 x 1.65: 9@2 1,0
DCJ0202 = drill 1 pad 2 long: 1 0,3.1; 2 4.8,0; 3 0,-3
L2012C = smd 1 x 1: 1 -1,0; 2 1,0
LED_SML0603 = smd 0.8 x 0.8: A 0.75,0; C -0.75,0
R0603 = smd 1 x 1.1: 1 -0.85,0; 2 0.85,0
BU-SMA-G = drill 1.27: 1 0,0 | drill 1.778: 2 -2.55,2.55; 3 2.55,2.55; 4 2.55,-2.55; 5 -2.55,-2.55
CUSTOM_TRANSFORMER = smd 1.651 x 0.762: 1 -1.587,-1.27; 2 -1.587,0; 3 -1.587,1.27; 4 1.587,1.27; 6 1.587,-1.27
P1-13 = drill 1.321 pad 2.159 octagon: TP 0,0
SM-T4 = smd 1 x 2: 1 -1.5,-1.75; 2 -1.5,1.75; 3 0,1.75; 4 1.5,1.75; 5 1.5,-1.75
MXO45 = drill 0.9 pad 1.778 octagon: 1 2.54,1.27; 4 17.78,1.27; 5 17.78,8.89; 8 2.54,8.89
RCFD1 = smd 1.016 x 1.524: 1 -9.65,-2.29; 2 -9.64,0.51; 7 10.75,0.51; 8 10.74,-2.29 | smd 1.524 x 1.016: 3 -5.46,5.43; 4 -1.45,5.43; 5 2.54,5.43; 6 6.55,5.43; 9 8.34,-4.57; 10 4.55,-4.57; 11 0.54,-4.57; 12 -3.45,-4.57; 13 -7.24,-4.57
ADL5320 = smd 0.5 x 1.62: GND1 0,-1.27 | smd 1.7 x 2.38: GND2 0,0.73 | smd 0.5 x 1.2: RFIN -1.5,-1.48; RFOUT 1.5,-1.48

### Placement (x,y rotation side)
06CS9N5  26.04,62.81 90 top
0603CS5N6  21.97,62.79 90 top
0603HP5N6  17.93,62.92 90 top
1401  71.68,10.46 180 top
1402  42.04,15.77 180 top
ADRF6655_DOWN  93.55,23.88 0 top
ADRF6655_UP  41.86,57.56 90 top
C1  89.76,30.4 90 top
C2  93.42,30.33 90 top
C3  91.8,30.3 90 top
C4  83.21,29.59 0 top
C5  83.21,31.09 0 top
C6  12.4,37.21 270 top
C7  96.29,30.35 90 top
C8  99.82,22.81 180 top
C9  99.8,24.23 180 top
C10  99.77,21.31 0 top
C11  26.95,35.56 270 top
C12  62,40.54 0 top
C13  102.21,61.06 0 top
C14  109.07,57.53 180 top
C15  86.64,27.99 180 top
C16  116.92,63.4 90 top
C17  114.4,63.4 90 top
C18  61.54,9.3 180 top
C19  54.91,17.14 180 top
C20  45.87,34.7 270 top
C21  54.89,19.2 180 top
C22  86.64,26.57 180 top
C23  54.89,20.95 180 top
C24  54.25,60.22 270 top
C25  53.37,66.62 0 top
C26  63.04,61.16 0 top
C27  86.69,21.67 180 top
C28  37.24,53.75 270 top
C29  35.48,52.12 270 top
C30  37.24,57.1 270 top
C31  32.79,57.89 180 top
C32  31.83,53.64 270 top
C33  62.94,47.32 90 top
C34  34.67,60.96 180 top
C35  43.21,63.8 270 top
C36  41.66,63.8 270 top
C37  97.71,30.35 90 top
C38  59.03,56.92 180 top
C39  44.73,63.8 90 top
C40  55.4,52.7 180 top
C41  28.93,14.61 180 top
C42  15.14,14.63 180 top
C43  35.18,28.04 180 top
C44  21.08,16.66 0 top
C45  21.08,18.72 0 top
C46  93.6,16.99 270 top
C47  94.82,30.33 90 top
C48  86.69,20.24 180 top
C49  86.61,29.57 180 top
C50  40.16,63.8 90 top
C51  39.12,50.57 270 top
C52  44.45,49.56 270 top
C53  49.02,57.89 0 top
C54  36.4,59.49 180 top
C55  14.81,66.93 90 top
C56  17.86,64.39 0 top
C57  18.87,66.93 90 top
C58  21.92,64.39 0 top
C59  22.94,66.93 90 top
C60  25.98,64.39 0 top
C61  27,66.93 90 top
C62  46.02,49.53 270 top
C63  37.62,50.6 270 top
C64  40.56,50.6 90 top
C65  42.93,49.56 90 top
C66  48.9,50.5 0 top
C67  48.97,53.37 0 top
C68  48.97,54.79 0 top
C69  86.69,23.06 180 top
C70  85.95,16.99 270 top
C71  92.08,16.99 270 top
C72  89.08,16.99 270 top
C74  31.78,41.45 180 top
C75  31.78,39.55 180 top
C80  96.29,15.8 90 top
C-DCL  13.79,64.39 0 top
D3  17.32,38.07 0 top
D4  22.02,36.04 90 top
G1  24.56,26.16 90 top
IC1  33.68,35.99 0 top
J1  5.51,38.07 270 top
L1  35.15,39.52 180 top
L4  113.39,57.53 180 top
L5  58.22,18.14 270 top
L6  53.26,62.87 0 top
L7  52.22,59.82 90 top
L8  55.27,56.9 0 top
L9  53.26,64.82 0 top
L10  55.27,54.86 0 top
L11  18.11,15.65 270 top
LED1  49.12,34.82 90 top
LED2  83.39,23.16 0 top
LED3  43.69,44.86 0 top
R1  84.07,25.6 270 top
R2  82.3,27.28 270 top
R3  35.53,57.1 90 top
R4  33.63,55.35 270 top
R5  86.69,24.41 180 top
R6  43.59,46.86 180 top
R7  87.55,16.99 270 top
R8  84.35,16.99 270 top
R9  90.6,17.02 270 top
R10  49.02,56.41 180 top
R11  48.06,48.06 90 top
R12  50.67,51.92 180 top
R13  97.89,15.77 90 top
R14  34.39,30.81 90 top
R15  32.66,30.81 270 top
R16  36.04,30.81 90 top
R17  37.54,30.84 90 top
R19  49.12,31.57 90 top
R20  65.86,48.23 0 top
R21  62.92,51.94 270 top
RFIN  7.44,64.39 180 top
RFOUT  7.37,14.63 0 bottom
T$2  58.34,59.84 180 top
T$3  105.41,22.96 0 top
TP1  51.66,44.55 0 top
TP2  51.79,48.95 0 top
TP3  51.74,55.91 0 top
TP4  74.5,18.52 0 top
TP5  78.03,16.13 0 top
TP6  81.46,13.89 0 top
TR1  93.09,11.07 270 top
TR4  31.32,65.91 90 top
U$1  55.93,28.4 0 top
U$2  82.85,63.35 0 top
U$3  108.36,62.51 0 top
U$4  115.39,31.88 270 top
U$5  22.02,13.13 180 top
U$6  57.12,10.79 90 top

### Tracks (layer width: path | path; a pad name or v marks a point on that pad's centre or on a via)
2.5V
  Top 0.305: C69.1 C27.1 88.03,22.13 ADRF6655_DOWN.9
2P5V
  Top 0.305: ADRF6655_UP.9 43.61,51.11 C65.2 C52.1
3.3V_LDO
  Top 0.305: ADRF6655_UP.2 40.11,54.21 39.67,53.77
  Top 0.406: 39.67,53.77 39.67,52.3 | 39.67,52.3 39.67,52.01 C51.1 | C64.2 40.5,51.47 39.67,52.3
3P3V_LDO
  Top 0.305: C15.1 C22.1 88.85,26.57 89.79,25.63 ADRF6655_DOWN.2
DOWN_CLK
  Top 0.305: R7.2 87.55,15.29 86.16,13.89 TP6.TP
DOWN_DATA
  Top 0.305: R8.2 78.04,16.14 TP5.TP
DOWN_LE  (via drill 0.6)
  Top 0.305: R9.2 90.6,14.78 v90.58,14.76
  Bottom 0.305: v90.58,14.76 84.2,14.76 80.44,18.52 TP4.TP
GND  (via drill 0.5 pad 0.25, 0.6 pad 0.25)  (1 unrouted)
  Top 0.127: ADRF6655_UP.24 ADRF6655_UP.23
  Top 0.254: ADRF6655_UP.35 40.34,57.81 v40.59,57.56 | ADRF6655_UP.28 40.61,58.97 v40.59,58.95 39.61,59.93 ADRF6655_UP.30 | ADRF6655_UP.7 42.61,55.61 v43.13,56.13 | ADRF6655_UP.4 41.11,55.61 v40.59,56.13 | ADRF6655_UP.15 43.35,57.31 v43.13,57.53 | ADRF6655_UP.23 v43.11,58.96 v43.1,58.95 44.11,59.96 ADRF6655_UP.21 | ADRF6655_DOWN.4 91.33,24.63 v92.05,23.9 91.27,23.13 ADRF6655_DOWN.7 | ADRF6655_DOWN.36 93.3,25.62 v93.55,25.38 | ADRF6655_DOWN.28 95.27,25.13 v95.02,25.38 | ADRF6655_DOWN.23 95.25,22.63 v95,22.38 95.75,21.63 ADRF6655_DOWN.21 | ADRF6655_DOWN.15 93.3,22.13 v93.55,22.38 | v92.08,22.38 91.42,21.72 91.42,21.59 91.3,21.47 ADRF6655_DOWN.11 | IC1.4 IC1.4@1
  Top 0.305: C22.2 C15.2 | C28.2 37.11,52.87 C29.2
  other vias: 84.1,27.99 96.01,18.14 32.26,61.04 28.09,51.79 25.55,54.33 25.55,56.87 25.55,59.41 25.55,51.79 23.01,51.79 23.01,54.33 23.01,56.87 23.01,59.41 20.45,59.36 20.45,56.82 20.45,54.28 20.45,51.74 17.91,54.28 17.91,56.82 17.91,59.36 17.91,51.74 15.37,51.74 15.37,54.28 15.37,56.82 15.37,59.36 12.8,51.77 12.8,54.31 12.8,56.85 10.24,56.79 10.24,54.25 10.24,51.71 7.7,54.25 7.7,56.79 7.7,51.71 16.48,26.39 16.48,23.85 16.48,21.31 13.94,23.85 13.94,26.39 13.94,21.31 11.4,21.31 11.4,23.85 11.4,26.39 8.43,23.8 8.43,21.26 12.04,8.38 9.5,8.38 6.96,8.38 19.68,8.43 17.14,8.43 14.61,8.43 22.2,8.46 29.95,10.97 29.95,8.43 27.41,8.43 27.41,10.97 24.87,8.43 24.87,10.97 37.59,11.02 37.59,8.48 35.05,8.48 35.05,11.02 32.51,8.48 32.51,11.02 45.19,11.05 45.19,8.51 42.65,8.51 42.65,11.05 40.11,8.51 40.11,11.05 52.83,11.1 52.83,8.56 50.29,8.56 50.29,11.1 47.75,8.56 47.75,11.1 116.79,19.05 114.25,19.05 111.71,19.05 64.52,68.63 64.52,66.09 61.98,68.63 61.98,66.09 59.44,66.09 59.44,68.63 122.07,19 122.07,16.46 122.05,24.05 122.05,21.51 116.84,10.87 116.84,8.33 116.89,5.69 114.3,8.33 114.3,10.87 111.84,5.59 111.76,8.33 111.76,10.87 108.94,8.26 106.05,8.26 122.02,11 122.02,13.54 119.46,10.95 41.86,58.95 41.86,57.53 41.86,56.13 95.02,23.9 92.08,25.37 93.55,23.88 38.2,16.59 40.77,16.66 43.33,16.64 45.77,16.61 45.82,15.09 43.28,15.09 40.77,15.09 38.2,15.11 75.44,9.83 72.95,9.8 72.97,11.4 70.41,11.38 67.79,11.38 67.79,9.8 70.41,9.8 115.82,22.56 112.01,23.55 112.04,27.36 112.09,31.42 112.04,35.38 112.09,39.17 115.82,40.21 119.38,37.34 119.41,33.35 119.43,25.37 91.14,60.15 92.28,63.91 89.41,67.44 85.37,67.51 81.43,67.46 77.37,67.46 87.38,60.05 83.41,60.1 79.4,60.1 74.5,63.93 75.62,60.07 75.44,11.35 107.26,26.34 33.1,63.09 62.59,19.79 54.53,51.08 52.43,68.22 114.38,65.84 116.89,65.74 92.33,32.99 82.7,21.21 82.7,19.33 119.46,13.49 116.87,13.49 114.25,13.49 111.73,13.59 114.5,68.48 111.94,68.43 111.94,65.89 109.4,68.43 109.4,65.89 106.86,65.89 106.86,68.43 104.29,65.91 104.29,68.45 101.73,68.4 101.73,65.86 99.19,68.4 99.19,65.86 24.92,74.02 24.92,71.48 22.38,71.48 22.38,74.02 19.81,73.96 19.81,71.42 17.27,73.96 17.27,71.42 14.73,71.42 14.73,73.96 12.17,71.45 12.17,73.99 9.6,73.94 9.6,71.4 7.06,73.94 7.06,71.4 30.51,74.04 30.51,71.5 27.97,74.04 27.97,71.5 53.77,74.04 53.77,71.5 51.23,71.5 51.23,74.04 48.67,73.99 48.67,71.45 46.13,73.99 46.13,71.45 43.59,71.45 43.59,73.99 41.02,71.48 41.02,74.02 38.46,73.96 38.46,71.42 35.92,73.96 35.92,71.42 33.2,74.04 33.2,71.5 59.36,74.07 59.36,71.53 56.82,74.07 56.82,71.53 64.8,74.04 64.8,71.5 62.05,74.07 62.05,71.53 85.37,74.04 85.37,71.5 82.83,71.5 82.83,74.04 80.26,73.99 80.26,71.45 77.72,73.99 77.72,71.45 75.18,71.45 75.18,73.99 72.62,71.48 72.62,74.02 70.05,73.96 70.05,71.42 67.51,73.96 67.51,71.42 90.96,74.07 90.96,71.53 88.42,74.07 88.42,71.53 93.65,74.07 93.65,71.53 93.65,68.5 93.65,65.96 96.47,74.04 96.47,71.5 96.47,68.48 96.47,65.94 117.04,74.04 117.04,71.5 114.5,71.5 114.5,74.04 111.94,73.99 111.94,71.45 109.4,73.99 109.4,71.45 106.86,71.45 106.86,73.99 104.29,71.48 104.29,74.02 101.73,73.96 101.73,71.42 99.19,73.96 99.19,71.42 119.61,53.16 119.61,50.62 119.61,48.08 119.61,45.54 119.61,55.85 119.61,58.47 119.61,61.01 119.61,64.01 119.61,66.93 78.26,57.18 78.26,54.64 78.26,52.1 78.26,49.56 75.56,57.18 75.56,54.64 75.56,52.1 75.56,49.56 73.03,52.1 73.03,54.64 73.03,57.18 73.03,49.56 73.08,41.38 78.23,41.45 78.23,43.99 75.64,43.99 70.13,57.2 70.13,54.66 70.13,52.12 70.13,49.58 67.59,52.12 67.59,54.66 67.59,57.2 67.59,49.58 65.05,49.58 65.05,52.12 65.05,54.66 65.05,57.2 73,46.79 78.21,46.86 55.73,45.77 46.15,47.04 58.67,45.85 33.58,48.79 33.58,46.25 30.89,48.79 30.89,46.25 28.35,48.79 28.35,46.25 25.3,48.77 25.3,46.23 22.76,46.23 22.76,48.77 20.19,48.72 20.19,46.18 17.65,48.72 17.65,46.18 15.11,46.18 15.11,48.72 12.55,46.2 12.55,48.74 9.98,48.69 9.98,46.15 7.44,48.69 7.44,46.15 47.75,42.67 47.75,40.13 45.21,42.67 45.21,40.13 47.73,45.47 50.44,40.13 55.68,42.72 55.68,40.18 55.68,37.64 55.68,35.1 53.14,37.64 53.14,40.18 58.67,49.4 53.14,35.1 58.7,42.72 58.7,40.18 53.11,32.33 55.8,32.41 55.75,29.36 53.21,29.36 60.12,22.5 122.22,60.96 122.22,58.42 122.22,55.88 122.22,53.34 122.17,64.03 122.3,66.8 122.2,45.49 122.2,42.95 122.17,50.55 122.17,48.01 122.15,37.49 122.15,40.03 119.58,39.98 119.56,42.85 122.1,34.47 122.1,31.93 122.1,29.39 122.1,26.85 119.48,21.59 119.48,19.05 119.48,29.36 108.74,18.72 108.74,16.18 108.74,13.64 108.74,11.1 111.61,16.28 114.22,16.28 116.92,16.36 119.43,16.36 100.43,16.08 103.07,16.08 100.43,13.54 103.15,13.54 103.28,11 100.43,11 103.4,8.18 100.51,8.18 105.87,16.05 105.84,13.56 105.92,11 78.26,38.33 78.26,35.79 78.26,33.25 78.26,30.71 75.56,38.33 75.56,35.79 75.56,33.25 75.56,30.71 75.62,22.53 73.08,22.53 78.23,22.61 78.23,25.15 75.64,25.15 73.03,25.15 75.69,28.02 78.21,28.02 100.86,54.58 100.86,52.04 100.86,49.5 100.86,46.96 100.86,57.28 103.48,57.3 103.48,54.76 103.45,46.91 103.45,44.37 103.43,51.97 103.43,49.43 103.4,38.91 103.4,41.45 100.84,38.86 100.84,41.4 100.81,44.27 103.35,35.89 103.35,33.35 100.74,33.4 100.74,35.89 103.35,30.58 103.35,28.04 100.74,28.09 100.74,30.58 70.13,68.63 70.13,66.09 67.59,66.09 67.59,68.63 72.64,68.63 67.64,17.22 64.97,17.22 70.1,17.22 70.08,19.84 67.59,19.84 67.64,14.83 70.15,14.88 65.05,19.76 64.92,14.78 62.61,17.17 62.56,14.78 114.3,5.61 114.3,3.02 116.94,3.05 24.59,5.54 24.59,3 22.05,3 22.05,5.54 19.48,5.49 19.48,2.95 16.94,5.49 16.94,2.95 14.4,2.95 14.4,5.49 11.84,2.97 11.84,5.51 9.27,5.46 9.27,2.92 6.73,5.46 6.73,2.92 30.18,5.56 30.18,3.02 27.64,5.56 27.64,3.02 53.44,5.56 53.44,3.02 50.9,3.02 50.9,5.56 48.34,5.51 48.34,2.97 45.8,5.51 45.8,2.97 43.26,2.97 43.26,5.51 40.69,3 40.69,5.54 38.13,5.49 38.13,2.95 35.59,5.49 35.59,2.95 32.87,5.56 32.87,3.02 59.03,5.59 59.03,3.05 56.49,5.59 56.49,3.05 64.47,5.56 64.47,3.02 61.72,5.59 61.72,3.05 85.04,5.56 85.04,3.02 82.5,3.02 82.5,5.56 79.93,5.51 79.93,2.97 77.39,5.51 77.39,2.97 74.85,2.97 74.85,5.51 72.29,3 72.29,5.54 69.72,5.49 69.72,2.95 67.18,5.49 67.18,2.95 90.63,5.59 90.63,3.05 88.09,5.59 88.09,3.05 93.32,5.59 93.32,3.05 96.14,5.56 96.14,3.02 111.61,2.97 108.97,5.56 109.07,2.97 106.3,2.97 106.27,5.54 103.68,3 103.56,5.59 101.09,5.51 101.22,2.95 98.86,5.49 98.86,2.95 5.92,28.98 8.46,28.98 8.46,26.44 5.84,26.42 14.02,31.6 14.02,34.14 14.02,29.06 11.48,29.06 11.48,31.6 11.48,34.14 108.28,59.54 56.31,8.56 19.66,11.02 42.32,24.77 47.37,22.2 44.7,22.2 49.83,22.2 49.81,24.82 47.32,24.82 44.78,24.74 42.34,22.15 52.63,24.89 60.12,24.94 57.63,24.94 55.09,24.87 62.59,25.1 67.64,22.53 64.97,22.53 70.1,22.53 70.08,25.15 67.59,25.15 65.05,25.07 62.61,22.48 110.92,55.63 110.92,53.09 110.92,50.55 110.92,48.01 113.97,53.09 113.97,50.55 113.97,48.01 113.97,45.47 113.97,55.78 116.59,55.8 116.59,53.26 116.56,45.42 116.54,50.47 116.54,47.93 108.56,38.89 108.56,41.43 105.99,38.84 105.99,41.38 108.51,35.86 108.51,33.32 105.89,33.38 105.89,35.86 108.51,30.56 105.89,30.56 97.28,38.46 97.28,35.92 94.74,38.46 94.74,35.92 92.2,35.92 92.2,38.46 89.64,35.94 89.64,38.48 87.07,38.43 87.07,35.89 84.53,38.43 84.53,35.89 81.81,44.07 81.81,41.53 81.81,38.51 81.81,35.97 97.28,44.02 97.28,41.48 94.74,44.02 94.74,41.48 92.2,41.48 92.2,44.02 89.64,41.5 89.64,44.04 87.07,43.99 87.07,41.45 84.53,43.99 84.53,41.45 75.56,46.81 32.89,35.99 30.91,36.04 32.64,28.09 39.52,30 45.39,54.18 52.02,53.7 49.71,49.07
  pour Top (isolate 0.305): -0.51,78.89 128.88,78.66 128.78,-2.16 -1.85,-1.7
  pour Bottom: 128.55,78.64 129.18,-2.36 -0.76,-0.66 -0.86,78.97
  pour Route2: -0.64,78.59 128.02,77.93 127.38,-0.81 -0.1,0
N$1
  Top 0.305: C30.1 38.18,57.03 38.18,56.16 38.53,55.81 ADRF6655_UP.39
  Top 0.406: R3.2 37.21,57.95 C30.1
N$2  (via drill 0.5 pad 0.25)
  Top 0.305: R1.2 82.39,24.75 v82.37,24.74 | v90.86,28.12 91.8,28.12 | 91.8,28.12 C3.1 | 91.8,28.12 ADRF6655_DOWN.39
  Bottom 0.305: v82.37,24.74 87.48,24.74 v90.86,28.12
N$3
  Top 0.406: 49.99,47.09 49.99,47.14
N$4
  Top 0.305: C1.1 91.41,31.18 C3.2 91.8,31.08 C2.1 | C1.1 89.32,29.53 89.32,29.63 87.86,31.09 C5.2 C4.2 | C1.1 89.76,27.15 90.14,26.77 ADRF6655_DOWN.40
N$5  (via drill 0.6 pad 0.25)
  Top 0.305: R20.2 v68.96,48.23 | v89.38,23.85 89.61,23.63 ADRF6655_DOWN.6
  Bottom 0.305: v68.96,48.23 80.24,38.23 80.24,24.79 81.58,23.44 89.26,23.44 89.38,23.57 v89.38,23.85
N$6
  Top 0.305: ADRF6655_DOWN.14 92.8,18.59 C71.1 R9.1 | R9.1
N$7
  Top 0.305: R8.1 85.93,17.84 C70.1 87.11,19.02 89.08,19.02 89.92,19.86 91.24,19.86 91.8,20.42 ADRF6655_DOWN.12
N$8
  Top 0.305: C7.1 96.29,28.78 97.33,27.74 97.33,25.91 97.05,25.63 ADRF6655_DOWN.29
N$9
  Top 0.254: 98.82,24.13 ADRF6655_DOWN.26
  Top 0.305: C9.2 98.82,24.13
N$10
  Top 0.254: 97.21,23.62 ADRF6655_DOWN.25
  Top 0.305: C8.2 98.02,22.81 97.21,23.62 | ADRF6655_DOWN.25
N$11
  Top 0.305: TR1.2 94.84,20.94 ADRF6655_DOWN.18
N$12
  Top 0.305: ADRF6655_DOWN.19 95.3,19.74 95.83,19.2 97.69,19.2 99.16,17.73 99.16,12.55 96.19,9.58 TR1.4
N$13
  Top 0.305: T$2.3 59.93,56.95 C38.1
N$14  (via drill 0.6 pad 0.25)
  Top 0.254: R3.1 35.51,56.22
  Top 0.305: R3.1 v35.53,54.61 | v40.72,53.11 40.61,53.36 ADRF6655_UP.3
  Top 0.406: R3.1 33.78,54.5 R4.2 31.85,54.5 C32.1
  Bottom 0.305: v35.53,54.61 36.14,54 39.57,54 40.36,53.21 v40.72,53.11
N$15
  Top 0.305: C29.1 35.26,52.77 C32.2 | 38.28,54.62 ADRF6655_UP.40
  Top 0.406: C31.2 31.92,56.4 30.76,55.24 30.76,53.84 C32.2 | C30.2 C28.1 | C28.1 38.28,54.62 | C28.1 35.59,52.97 C29.1
N$16
  Top 0.406: C33.1 64.55,46.45 U$1.5
N$17
  Top 0.406: C26.2 73.1,61.16 U$2.1
N$18
  Top 0.305: ADRF6655_UP.13 46.74,56.31 47.17,55.88 47.17,54.03 47.83,53.37 C67.1 48.1,52.72 48.95,51.92 R12.2
N$19
  Top 0.305: ADRF6655_UP.29 40.11,60.96 39.7,61.37 35.95,61.37 C34.1
N$20
  Top 0.305: C35.2 43.2,62.61 42.14,61.54 42.14,60.48 ADRF6655_UP.25
N$21
  Top 0.305: C36.2 41.61,62.88 ADRF6655_UP.26
N$22
  Top 0.305: RFIN.1 C-DCL.1
N$23
  Top 0.305: C55.1 14.67,65.91 C-DCL.2 C56.1 17.17,64.2 0603HP5N6.P$2
N$24
  Top 0.406: U$5.RFIN C41.2
N$25
  Top 0.305: C61.1 26.86,65.91 C60.2 | C60.2 26.88,64.41 TR4.2 | C60.2 26.67,64.2 06CS9N5.P$1
N$26
  Top 0.305: C58.2 C60.1 25.4,64.1 06CS9N5.P$2 | C59.1 22.8,65.91 C58.2 | C58.2 22.61,64.2 0603CS5N6.P$1
N$27
  Top 0.305: C56.2 C58.1 21.34,64.1 0603CS5N6.P$2 | C57.1 18.73,65.91 C56.2 | C56.2 18.57,64.22 0603HP5N6.P$1
N$28
  Top 0.305: U$2.8 C13.1
N$29
  Top 0.305: R11.2 48.06,50.46 C66.1 48.03,51.66 46.61,53.09 46.61,55.58 46.38,55.81 ADRF6655_UP.12
N$30
  Top 0.406: R4.1 33.63,57.85 C31.1
N$31
  Top 0.305: C4.1 82.33,28.17 R2.1
N$32
  Top 0.305: C14.1 L4.2
  Top 0.406: U$3.RFOUT 109.94,61.03 C14.1
N$33
  Top 0.305: ADRF6655_UP.8 43.11,52.18 42.01,51.08 42.01,47.59 R6.2
N$34
  Top 0.305: R6.1 LED3.A
N$35
  Top 0.406: U$4.1 108.19,46.44 C14.2
N$36
  Top 0.406: 90.6,16.13 90.63,16.15
N$37
  Top 0.254: R16.2 34.18,33.52 IC1.5
N$38
  Top 0.305: ADRF6655_DOWN.3 89.2,25.13 88.85,25.48 84.94,25.48 84.1,26.31 R1.1 82.32,26.45 R2.2 81.33,27.39 81.33,30.18 82.25,31.09 C5.1
N$39
  Top 0.305: L5.2 58.21,17.14 C19.1
  Top 0.406: U$6.RFOUT 58.22,12.29 L5.2
N$40
  Top 0.305: 1401.P$5 64.69,9.3 C18.1
N$41
  Top 0.305: C19.2 1402.P$11
N$42
  Top 0.305: ADRF6655_UP.19 50.71,59.31 L7.2 52.22,62.82 L6.1 L9.1
N$43
  Top 0.305: ADRF6655_UP.18 44.77,58.82 L7.1 52.21,58.81 L8.1 L10.1
N$44
  Top 0.305: R7.1 89.05,17.84 C72.1 90.23,19.02 91.64,19.02 92.3,19.68 ADRF6655_DOWN.13
N$45
  Top 0.406: T$3.6 112.55,21.69 U$4.8
N$47
  Top 0.305: C24.2 55.98,59.35 T$2.4 56.27,58.31 L8.2
N$48  (via drill 0.6 pad 0.25)
  Top 0.305: ADRF6655_UP.6 42.11,54.64 v42.11,53.11 | v62.89,54.86 62.92,54.84 R21.1
  Bottom 0.305: v42.11,53.11 42.49,52.83 61.19,52.83 62.89,54.94 v62.89,54.86
N$49
  Top 0.305: R20.1 C33.2 62.92,48.25 R21.2
N$50
  Top 0.305: R13.1 C80.1 96.34,14.87 96.34,11.38 96.04,11.07 TR1.3
N$51
  Top 0.305: 76.8,9.57 1401.P$12
  Top 0.406: TR1.5 76.8,9.57
N$52
  Top 0.305: 90.59,11.83 TR1.1
  Top 0.406: 1401.P$11 90.59,11.83
N$53
  Top 0.406: U$6.RFIN C18.2
N$54
  Top 0.305: L11.2 18.09,14.63 C42.1
  Top 0.406: L11.2 20.52,14.65 U$5.RFOUT
N$55
  Top 0.305: 1402.P$5 C41.1
N$56
  Top 0.305: RFOUT.1 C42.2
N$57
  Top 0.406: C9.1 T$3.3
N$58
  Top 0.406: T$3.1 102.92,21.69 101.8,22.81 C8.1
N$59
  Top 0.406: TR4.5 41.48,67.41 43.2,65.68 C35.1
N$60
  Top 0.406: TR4.4 30.45,67.41 31.9,65.96 41.4,65.96 41.68,65.68 41.68,64.7 C36.1
N$61
  Top 0.305: ADRF6655_UP.14 47.78,56.81 R10.2 48.17,54.86 C68.1
N$62
  Top 0.254: 88.7,22.63 88.44,22.89 88.44,23.72 87.76,24.41
  Top 0.305: ADRF6655_DOWN.8 88.7,22.63 | 87.76,24.41 R5.1
N$63
  Top 0.406: U$3.RFIN 103.08,61.03 C13.2
N$64
  Top 0.305: T$2.1 59.98,61.16
  Top 0.406: 59.98,61.16 C26.1
N$65
  Top 0.254: R17.2 36.44,32.79 35.69,32.79 34.68,33.8 IC1.6
N$66
  Top 0.254: R16.1 36.05,29.95 C43.1
N$67
  Top 0.254: R14.2 33.43,32.62 | 33.43,32.62 33.18,32.87 IC1.3 | R15.1 33.43,32.43 33.43,32.62
N$69
  Top 0.254: C75.1 32.65,39.28 33.68,38.25 IC1.11
N$72
  Top 0.305: R5.2 85.38,24.41 LED2.A
N$73
  Top 0.254: 30.56,38.1 32.18,38.1 IC1.14 IC1.13
  Top 0.406: D3.K 22.02,38.08 D4.K C11.1 30.56,38.1
N$74
  Top 0.406: G1.+ D4.A
N$75  (via drill 0.6 pad 0.3)
  Top 0.254: IC1.9@2 IC1.9 34.68,38.05 L1.1 | IC1.12 33.18,37.84 32.44,38.58 31.87,38.58 C75.2
  Top 0.406: IC1.9 34.68,36.02 v36.63,36.02 | v28.55,40.31 29.31,39.55 C75.2
  Bottom 0.406: v36.63,36.02 32.33,40.31 v28.55,40.31
N$76
  Top 0.406: LED1.C R19.2
N$78
  Top 0.406: J1.1 12.39,38.08 C6.1 15.27,38.09 D3.A
UP_CLK
  Top 0.305: TP2.TP 51.79,51.65 R12.1
UP_DATA
  Top 0.305: TP1.TP 50.71,44.55 R11.1
UP_LE
  Top 0.305: R10.1 51.23,56.41 TP3.TP
VCC  (via drill 0.5 pad 0.25, 0.6 pad 0.25, 1.3 pad 1.27)
  Top 0.254: 32.69,33.55 IC1.2 | L1.2 34.18,39.5 IC1.10
  Top 0.305: ADRF6655_UP.34 38.45,58.31 C54.1 37.29,59.5 v37.29,60.63 | C25.2 54.24,64.84 L9.2 | L9.2 L6.2 54.26,61.11 C24.1 56.74,61.1 T$2.6 | C40.1 L10.2 57.99,54.86 v58.01,54.84 | 90.62,26.16 ADRF6655_DOWN.1 90.64,26.11 90.07,26.11 88.88,27.3 v88.88,27.94 88.88,28.68 87.99,29.57 C49.1 | ADRF6655_DOWN.34 94.3,28.93 C47.1 94.28,28.92 94.28,28.68 93.67,28.07 v92.96,28.07 | ADRF6655_DOWN.27 96.46,24.64 97.1,24.64 97.97,25.5 97.97,27.91 97.71,28.17 C37.1 97.75,29.48 98.81,30.53 v98.81,33.66 | L5.1 58.18,19.17 C21.1 55.74,20.12 C23.1 55.77,22.39 v55.75,22.5 | L11.1 20.19,16.65 C44.1 C45.1 20.21,20.41 v20.12,20.5 | ADRF6655_UP.10 44.11,52.32 45.66,50.77 | 45.66,50.77 C62.1 | v45.92,51.51 45.92,51.03 45.66,50.77 | C53.1 47.89,58.14 46.91,58.14 v46.69,57.91 46.29,58.31 ADRF6655_UP.17 | L9.2 55.83,64.82 v55.91,64.75 | ADRF6655_DOWN.10 89.39,21.63 v89,21.23 88.01,20.24 C48.1 | C16.1 C17.1 114.4,60.09 L4.1 v116.1,57.53 | R13.2 97.89,17.68 v97.48,18.09 | C46.1 93.6,19.46 v93.55,19.51 94.3,20.26 ADRF6655_DOWN.17 | v97.48,20.45 98.35,21.31 | 98.35,21.31 C10.1 | ADRF6655_DOWN.22 97.53,22.13 98.35,21.31 | C39.1 44.73,62.64 | 44.73,62.64 43.61,61.52 ADRF6655_UP.22 | ADRF6655_UP.27 41.11,61.48 40.16,62.43 C50.1 40.12,62.89 v38.73,62.89 | 44.73,62.64 44.96,62.41 v44.96,61.37 | 37.32,51.47 C63.1 37.62,51.56 38.79,52.73 v38.79,53.21 38.79,53.84 ADRF6655_UP.1
  Top 0.406: C12.1 61.13,39.94 U$1.8 | R15.2 30.28,32.35 v30.28,33.17 32.31,33.17 32.69,33.55 | v43.03,35.56 C20.1 LED1.A | L1.2 35,40.37 v35,41.63 32.83,41.63 C74.1
  pour Route3: -0.64,77.67 128.27,78.26 128.63,-2.18 0,-0.08

### Text on the board
tPlace: RCFD1-1310BP5 | TC1-1-13M+ | 06HP5N6 | 06CS5N6 | 06CS9N5 | 0-1GHz signal / Receiver ™ / MYQ team 2015 | RCFD1-1310BP5 | TC1-1-13M+ | sf2140a | sf2140a | TC4-1W+